# Altium schematic sheet DASHBOARD.SchDoc
size 381 x 304 mm; SheetNumber: 1; SheetTotal: 1
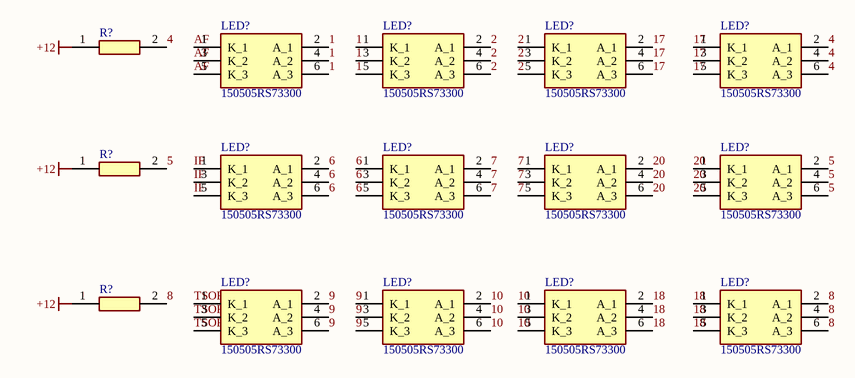
[diagram p0: DASHBOARD.SchDoc]

## Parts
(Parts that share a designator on the sheet are numbered #1, #2 ... from top to bottom, then left to right.)
LED?#1  150505RS73300  [150505RS73300]
LED?#2  150505RS73300  [150505RS73300]
LED?#3  150505RS73300  [150505RS73300]
LED?#4  150505RS73300  [150505RS73300]
LED?#5  150505RS73300  [150505RS73300]
LED?#6  150505RS73300  [150505RS73300]
LED?#7  150505RS73300  [150505RS73300]
LED?#8  150505RS73300  [150505RS73300]
LED?#9  150505RS73300  [150505RS73300]
LED?#10  150505RS73300  [150505RS73300]
LED?#11  150505RS73300  [150505RS73300]
LED?#12  150505RS73300  [150505RS73300]
R?#1  CPF0805B100RE1  [RESC2012X65N]  (value not drawn)
R?#2  CPF0805B100RE1  [RESC2012X65N]  (value not drawn)
R?#3  CPF0805B100RE1  [RESC2012X65N]  (value not drawn)

## Nets
+12: R?#1.1 R?#2.1 R?#3.1
1: LED?#1.2(A_1) LED?#1.4(A_2) LED?#1.6(A_3) LED?#2.1(K_1) LED?#2.3(K_2) LED?#2.5(K_3)
2: LED?#2.2(A_1) LED?#2.4(A_2) LED?#2.6(A_3) LED?#3.1(K_1) LED?#3.3(K_2) LED?#3.5(K_3)
4: LED?#4.2(A_1) LED?#4.4(A_2) LED?#4.6(A_3) R?#1.2
5: LED?#8.2(A_1) LED?#8.4(A_2) LED?#8.6(A_3) R?#2.2
6: LED?#5.2(A_1) LED?#5.4(A_2) LED?#5.6(A_3) LED?#6.1(K_1) LED?#6.3(K_2) LED?#6.5(K_3)
7: LED?#6.2(A_1) LED?#6.4(A_2) LED?#6.6(A_3) LED?#7.1(K_1) LED?#7.3(K_2) LED?#7.5(K_3)
8: LED?#12.2(A_1) LED?#12.4(A_2) LED?#12.6(A_3) R?#3.2
9: LED?#9.2(A_1) LED?#9.4(A_2) LED?#9.6(A_3) LED?#10.1(K_1) LED?#10.3(K_2) LED?#10.5(K_3)
10: LED?#10.2(A_1) LED?#10.4(A_2) LED?#10.6(A_3) LED?#11.1(K_1) LED?#11.3(K_2) LED?#11.5(K_3)
17: LED?#3.2(A_1) LED?#3.4(A_2) LED?#3.6(A_3) LED?#4.1(K_1) LED?#4.3(K_2) LED?#4.5(K_3)
18: LED?#11.2(A_1) LED?#11.4(A_2) LED?#11.6(A_3) LED?#12.1(K_1) LED?#12.3(K_2) LED?#12.5(K_3)
20: LED?#7.2(A_1) LED?#7.4(A_2) LED?#7.6(A_3) LED?#8.1(K_1) LED?#8.3(K_2) LED?#8.5(K_3)
AF: LED?#1.1(K_1) LED?#1.3(K_2) LED?#1.5(K_3)
IF: LED?#5.1(K_1) LED?#5.3(K_2) LED?#5.5(K_3)
TSOFF: LED?#9.1(K_1) LED?#9.3(K_2) LED?#9.5(K_3)

## Library data of the parts
LED?#1-LED?#12 = 150505RS73300: LED; Manufacturer_Name: Wurth Elektronik; Datasheet Link: https://www.we-online.com/catalog/datasheet/150505RS73300.pdf; Height: 1.65mm; Manufacturer_Part_Number: 150505RS73300; Mouser Part Number: 710-150505RS73300; Mouser Price/Stock: https://www.mouser.co.uk/ProductDetail/Wurth-Elektronik/150505RS73300?qs=GedFDFLaBXFwseFXntEuXA%3D%3D
R?#1-R?#3 = CPF0805B100RE1: Resistor; Manufacturer_Name: TE Connectivity; Datasheet Link: https://datasheet.datasheetarchive.com/originals/distributors/DKDS-21/401696.pdf; Height: 0.65mm; Manufacturer_Part_Number: CPF0805B100RE1; Mouser Part Number: 279-CPF0805B100RE1; Mouser Price/Stock: https://www.mouser.co.uk/ProductDetail/TE-Connectivity-Holsworthy/CPF0805B100RE1?qs=9ylKvqdyudkCWLPT1QvLZQ%3D%3D; Arrow Part Number: CPF0805B100RE1; Arrow Price/Stock: https://www.arrow.com/en/products/cpf0805b100re1/te-connectivity?region=nac